# EAGLE board DZ60_Demoboard_V10_DLN18703 (EAGLE 9.6.2)
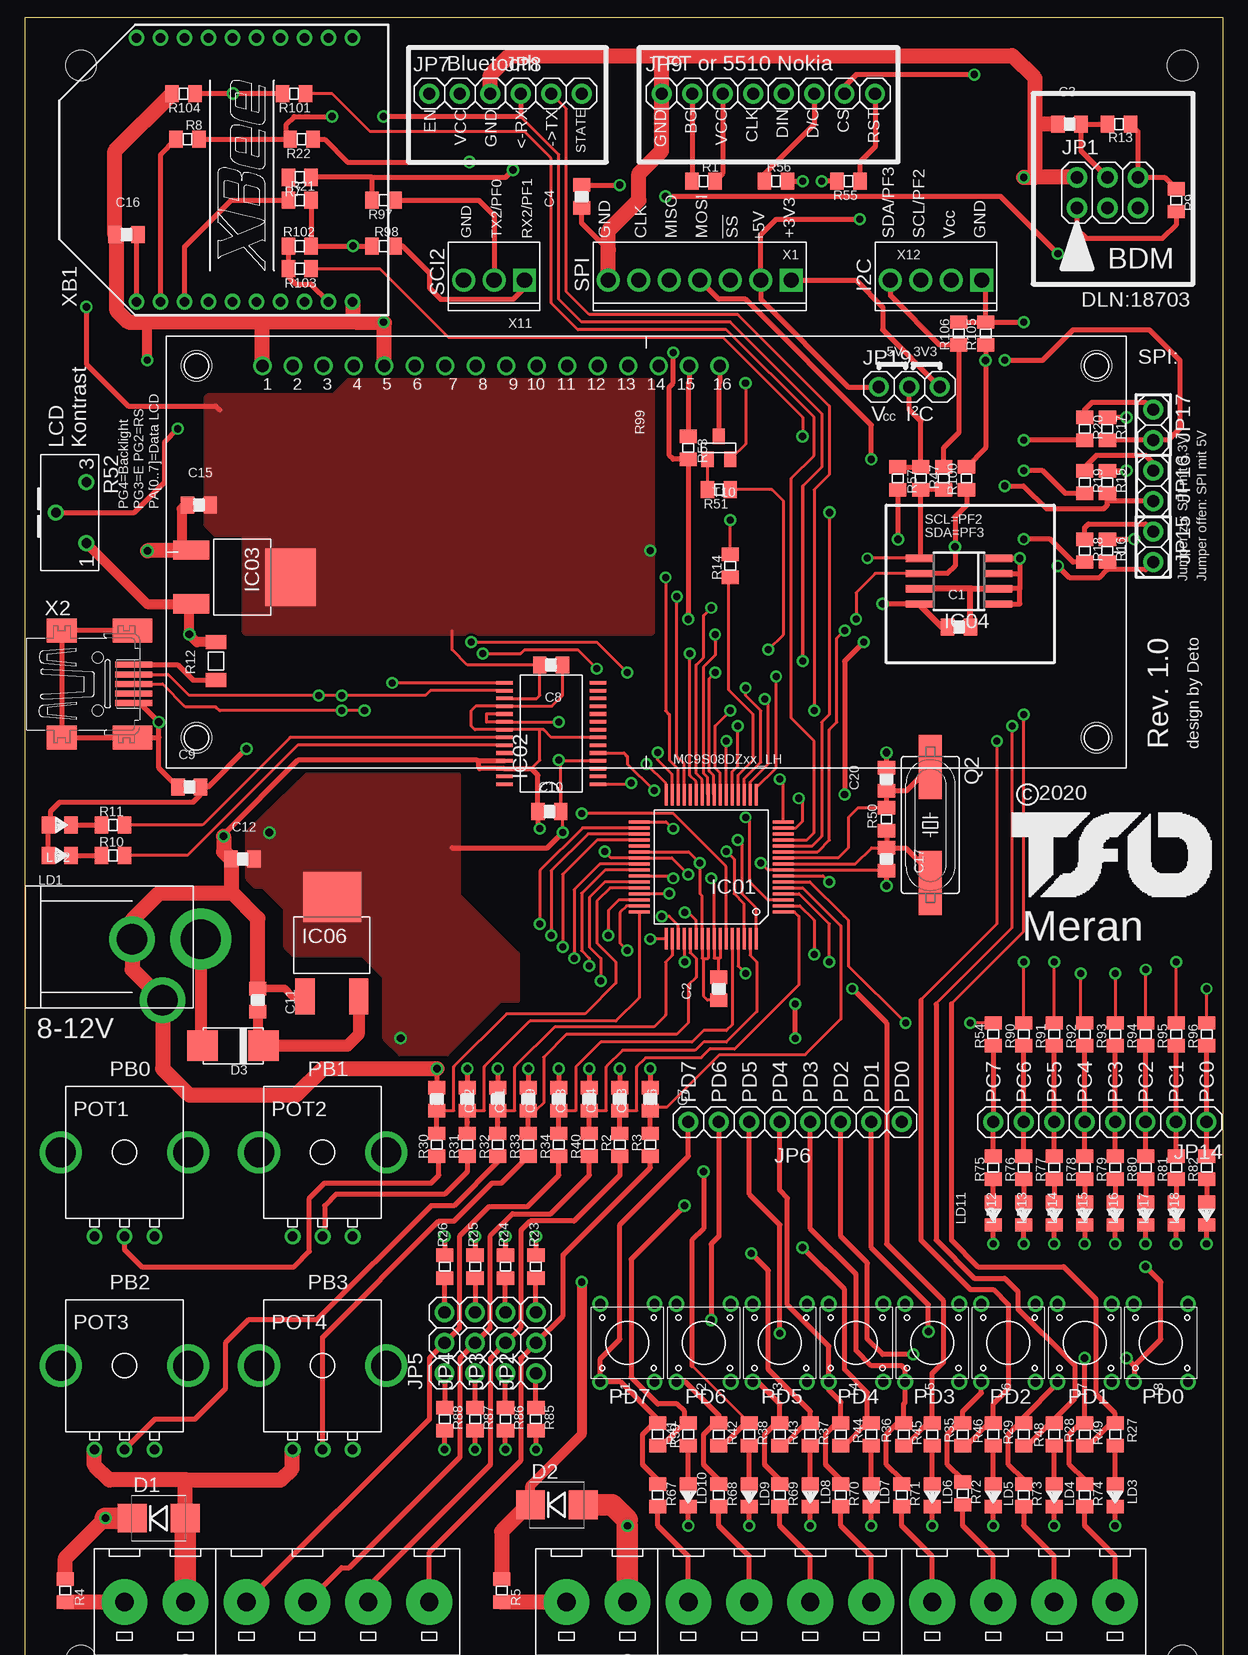
[diagram p4: board, top side]
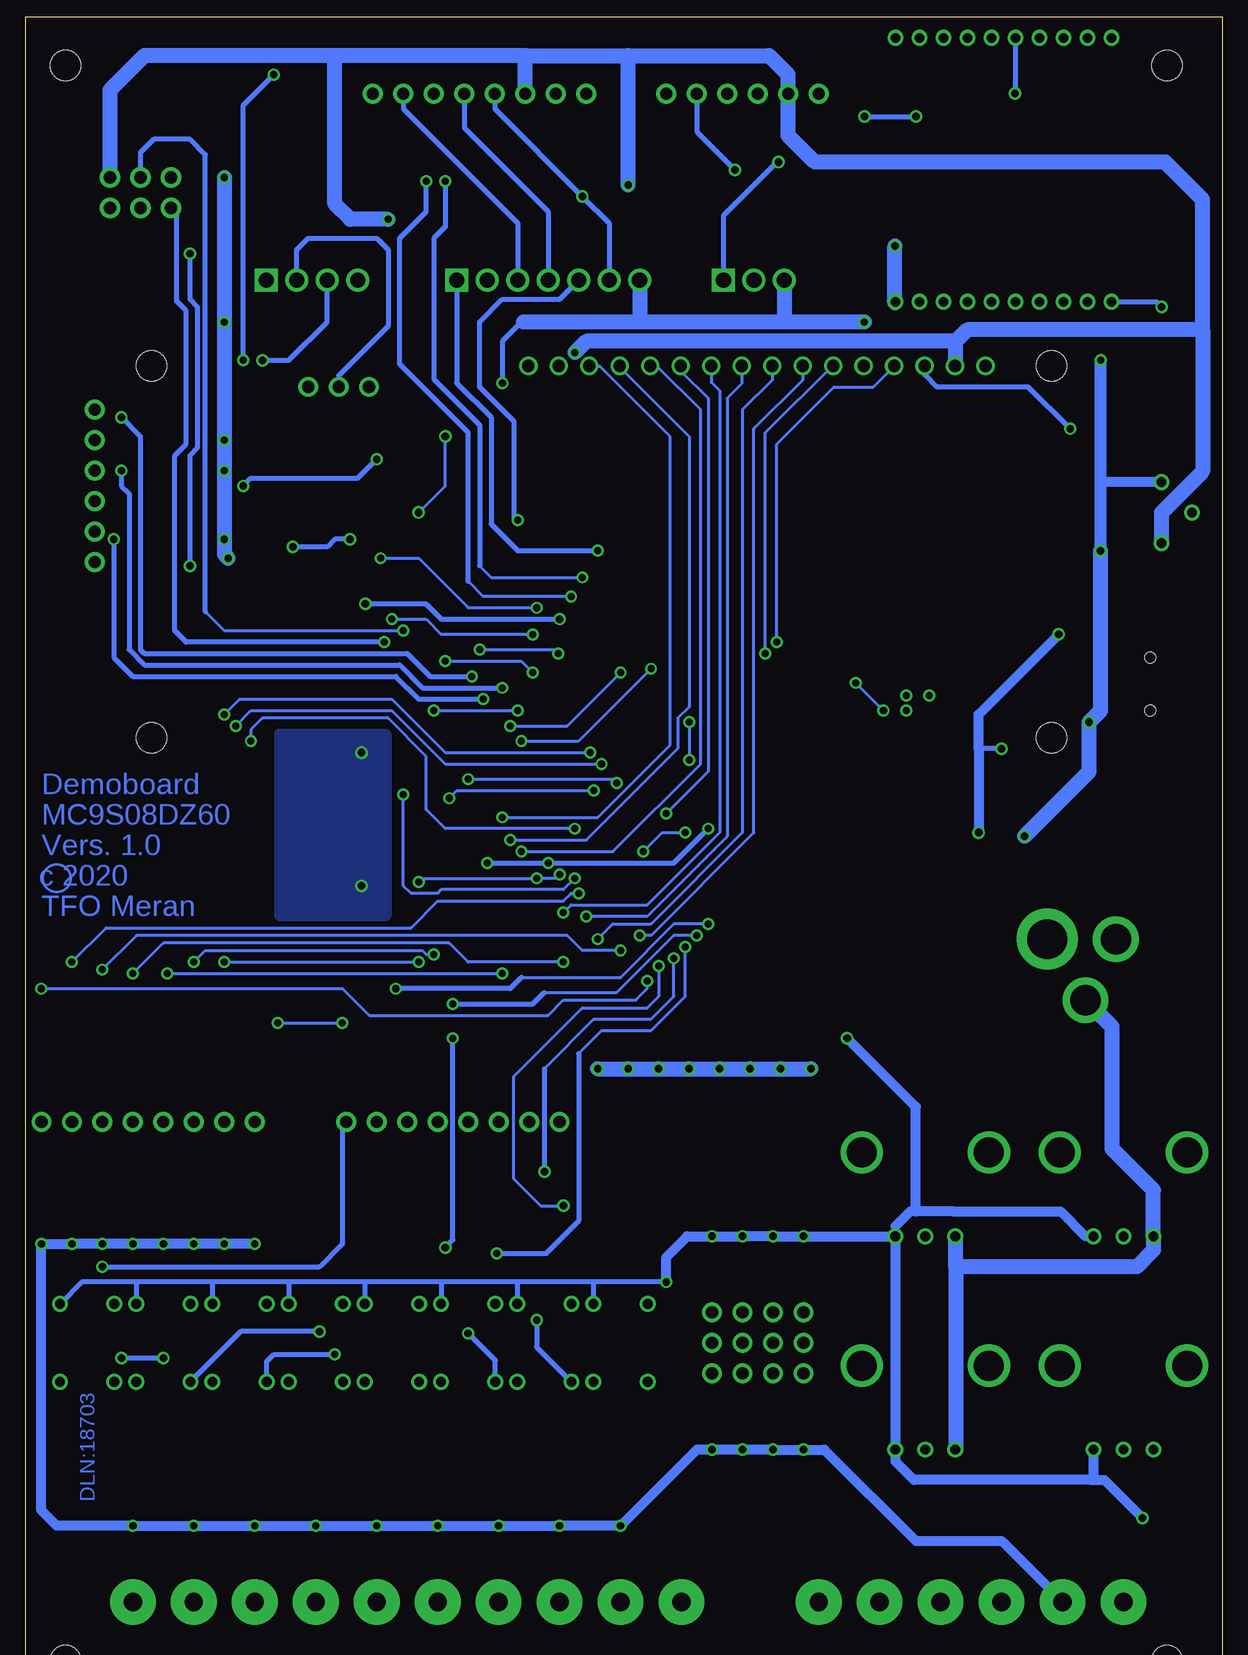
[diagram p5: board, bottom side, seen from below]

No outline drawn. Coordinates in mm, seen from the top.
Copper layers (1*16): Top 0.035mm / dielectric 1.5mm / Bottom 0.035mm
Design rules "default *": minimum track width 10mil, minimum drill 23mil, track to track 8mil, track to pad 8mil, pad to pad 8mil, via to via 8mil, smd to smd 0mil, copper to edge 40mil, drill to drill 8mil, minimum pad ring 10mil, minimum via ring 8mil, stop-mask expansion 0mil, vias tented up to drill 0mil, thermal gap 10mil
Holes 2.54 mm at 4.63,136.97 96.41,136.97 96.41,4 4.63,4
Milling: 4 lines

## Footprints (pad centres in the part's own frame; a part is rotated, then mirrored left to right if it is on the bottom)
0805F = smd 1.118 x 1.422: 1 -0.953,0; 2 0.953,0
SMB = smd 2.4 x 2.4: A 2.2,0; C -2.2,0
MELF_B = smd 2.54 x 2.54: A 2.54,0; K -2.54,0
LQFP64 = smd 1.778 x 0.254: 1 -6,3.75; 2 -6,3.25; 3 -6,2.75; 4 -6,2.25; 5 -6,1.75; 6 -6,1.25; 7 -6,0.75; 8 -6,0.25; 9 -6,-0.25; 10 -6,-0.75; 11 -6,-1.25; 12 -6,-1.75; 13 -6,-2.25; 14 -6,-2.75; 15 -6,-3.25; 16 -6,-3.75; 33 6,-3.75; 34 6,-3.25; 35 6,-2.75; 36 6,-2.25; 37 6,-1.75; 38 6,-1.25; 39 6,-0.75; 40 6,-0.25; 41 6,0.25; 42 6,0.75; 43 6,1.25; 44 6,1.75; 45 6,2.25; 46 6,2.75; 47 6,3.25; 48 6,3.75 | smd 0.254 x 1.778: 17 -3.75,-6; 18 -3.25,-6; 19 -2.75,-6; 20 -2.25,-6; 21 -1.75,-6; 22 -1.25,-6; 23 -0.75,-6; 24 -0.25,-6; 25 0.25,-6; 26 0.75,-6; 27 1.25,-6; 28 1.75,-6; 29 2.25,-6; 30 2.75,-6; 31 3.25,-6; 32 3.75,-6; 49 3.75,6; 50 3.25,6; 51 2.75,6; 52 2.25,6; 53 1.75,6; 54 1.25,6; 55 0.75,6; 56 0.25,6; 57 -0.25,6; 58 -0.75,6; 59 -1.25,6; 60 -1.75,6; 61 -2.25,6; 62 -2.75,6; 63 -3.25,6; 64 -3.75,6
SSOP28 = smd 1.4 x 0.3: 1 -3.9,4.225; 2 -3.9,3.575; 3 -3.9,2.925; 4 -3.9,2.275; 5 -3.9,1.625; 6 -3.9,0.975; 7 -3.9,0.325; 8 -3.9,-0.325; 9 -3.9,-0.975; 10 -3.9,-1.625; 11 -3.9,-2.275; 12 -3.9,-2.925; 13 -3.9,-3.575; 14 -3.9,-4.225; 15 3.9,-4.225; 16 3.9,-3.575; 17 3.9,-2.925; 18 3.9,-2.275; 19 3.9,-1.625; 20 3.9,-0.975; 21 3.9,-0.325; 22 3.9,0.325; 23 3.9,0.975; 24 3.9,1.625; 25 3.9,2.275; 26 3.9,2.925; 27 3.9,3.575; 28 3.9,4.225
DPAK = smd 1.6 x 2.997: 1 -2.261,-3.658; 3 2.21,-3.658 | smd 4.826 x 4.191: 4 0,4.623
SO-08M = smd 0.6 x 2.2: 1 -1.905,-3.33; 2 -0.635,-3.33; 3 0.635,-3.33; 4 1.905,-3.33; 5 1.905,3.33; 6 0.635,3.33; 7 -0.635,3.33; 8 -1.905,3.33
2X03 = drill 1.016 pad 1.676: 1 -2.54,-1.27; 2 -2.54,1.27; 3 0,-1.27; 4 0,1.27; 5 2.54,-1.27; 6 2.54,1.27
1X03 = drill 1.016 pad 1.651: 1 -2.54,0; 2 0,0; 3 2.54,0
1X08 = drill 1.016 pad 1.651: 1 -8.89,0; 2 -6.35,0; 3 -3.81,0; 4 -1.27,0; 5 1.27,0; 6 3.81,0; 7 6.35,0; 8 8.89,0
1X02 = drill 1.016 pad 1.651: 1 -1.27,0; 2 1.27,0
0805LED = smd 1.118 x 1.422: A 0.953,0; K -0.953,0
ALPS_VERTICAL = drill 0.813: 1 -2.5,0; 2 0,0; 3 2.5,0 | drill 2.5: C1 -5.3,7; C2 5.3,7
HC49UP = smd 5.334 x 1.93: 1 -4.826,0; 2 4.826,0
0805 = smd 1.118 x 1.422: 1 -0.953,0; 2 0.953,0
1206 = smd 1.168 x 1.727: 1 -1.587,0; 2 1.587,0
S63X = drill 0.813: 1 2.54,0; 2 0,-2.54; 3 -2.54,0
TASTE_THT = drill 0.813: A1 -3.251,2.261; A2 3.251,2.261; B1 -3.251,-2.261; B2 3.251,-2.261
SOT-23 = smd 1.016 x 1.27: 1 -0.953,0.953; 2 0.953,0.953; 3 0,-0.953
MX7 = drill 1.27 square: 1 -7.62,0 | drill 1.27: 2 -5.08,0; 3 -2.54,0; 4 0,0; 5 2.54,0; 6 5.08,0; 7 7.62,0
32005-201 = smd 3.1 x 0.5: 1 3,1.6; 2 3,0.8; 3 3,0; 4 3,-0.8; 5 3,-1.6 | smd 2.5 x 2: M1 -3,-4.45; M2 -3,4.45 | smd 3.3 x 2: M3 2.9,4.45; M4 2.9,-4.45 | hole 0.9: 0,2.2; 0,-2.2
KLEMME2 = drill 1.524 pad 3.81: 1 0,-2.54; 2 0,2.54
SPP = drill 2.54 pad 3.81: 1 0,0; 3 -2.54,5.08 | drill 3.302 pad 5.08: 2 -5.715,0
KLEMME4 = drill 1.524 pad 3.81: 1 0,-7.62; 2 0,-2.54; 3 0,2.54; 4 0,7.62
FDCC1602G = drill 1.016: 1 8,33.5; 2 10.54,33.5; 3 13.08,33.5; 4 15.62,33.5; 5 18.16,33.5; 6 20.7,33.5; 7 23.24,33.5; 8 25.78,33.5; 9 28.32,33.5; 10 30.86,33.5; 11 33.4,33.5; 12 35.94,33.5; 13 38.48,33.5; 14 41.02,33.5; 15 43.56,33.5; 16 46.1,33.5 | hole 2.54: 2.5,2.5; 77.5,2.5; 77.5,33.5; 2.5,33.5
MX3 = drill 1.27 square: 1 -2.54,0 | drill 1.27: 2 0,0; 3 2.54,0
MX4 = drill 1.27 square: 1 -3.81,0 | drill 1.27: 2 -1.27,0; 3 1.27,0; 4 3.81,0
XBEE = drill 0.8 pad 1.27: 1 -11,9; 2 -11,7; 3 -11,5; 4 -11,3; 5 -11,1; 6 -11,-1; 7 -11,-3; 8 -11,-5; 9 -11,-7; 10 -11,-9; 11 11,-9; 12 11,-7; 13 11,-5; 14 11,-3; 15 11,-1; 16 11,1; 17 11,3; 18 11,5; 19 11,7; 20 11,9

## Placement (x,y rotation side)
C1  100nF  [0805F]  77.79,90.17 0 top
C2  100nF  [0805F]  57.78,60.01 90 top
C3  100nF  [0805F]  87,132.08 0 top
C4  100nF  [0805F]  46.35,126.05 90 top
C6  10nF  [0805F]  49.53,50.8 270 top
C7  10nF  [0805F]  52.07,50.8 270 top
C8  100nF  [0805F]  43.81,87 180 top
C9  100nF  [0805F]  13.65,76.83 0 top
C10  100nF  [0805F]  43.66,74.77 0 top
C11  1µF  [0805F]  19.37,59.05 270 top
C12  1µF  [0805F]  18.1,70.8 0 top
C13  10nF  [0805F]  46.99,50.8 270 top
C14  10nF  [0805F]  44.45,50.8 270 top
C15  1µF  [0805F]  14.45,100.33 0 top
C16  100nF  [0805F]  8.41,122.87 0 top
C17  10pF  [0805F]  71.75,70.8 270 top
C18  10nF  [0805F]  41.91,50.8 270 top
C19  10nF  [0805F]  39.37,50.8 270 top
C20  10pF  [0805F]  71.75,77.47 90 top
C21  10nF  [0805F]  36.83,50.8 270 top
C22  10nF  [0805F]  34.29,50.8 270 top
D1  SA5.0CA  [SMB]  11.11,15.88 0 top
D2  SA5.0CA  [SMB]  44.29,16.99 0 top
D3  1N4007  [MELF_B]  17.3,55.24 180 top
IC01  MC9S08DZ60LH  [LQFP64]  57.15,70.17 180 top
IC02  FT232RL  [SSOP28]  43.81,81.28 180 top
IC03  LM1117-3V3  [DPAK]  17.46,94.3 270 top
IC04  24LC256  [SO-08M]  77.79,93.98 90 top
IC06  LM1117-5.0  [DPAK]  25.56,63.02 0 top
JP1  [2X03]  90.17,126.37 0 top
JP2  [1X03]  42.54,30.48 90 top
JP3  [1X03]  40,30.48 90 top
JP4  [1X03]  37.46,30.48 90 top
JP5  [1X03]  34.92,30.48 90 top
JP6  [1X08]  64.14,48.9 180 top
JP7  [1X03]  36.2,134.62 0 top
JP8  [1X03]  43.81,134.62 0 top
JP9  [1X08]  61.91,134.62 0 top
JP14  [1X08]  89.54,48.89 180 top
JP15  [1X02]  93.98,96.84 270 top
JP16  [1X02]  93.98,101.92 270 top
JP17  [1X02]  93.98,107 270 top
JP19  [1X03]  73.66,110.17 0 top
LD1  RED  [0805LED]  2.86,71.12 180 top
LD2  GRN  [0805LED]  2.86,73.66 180 top
LD3  [0805LED]  90.81,17.78 90 top
LD4  [0805LED]  85.72,17.78 90 top
LD5  [0805LED]  80.64,17.78 90 top
LD6  [0805LED]  75.56,17.78 90 top
LD7  [0805LED]  70.48,17.78 90 top
LD8  [0805LED]  65.4,17.78 90 top
LD9  [0805LED]  60.32,17.78 90 top
LD10  [0805LED]  55.24,17.78 90 top
LD11  [0805LED]  80.64,41.28 90 top
LD12  [0805LED]  83.18,41.28 90 top
LD13  [0805LED]  85.72,41.28 90 top
LD14  [0805LED]  88.26,41.28 90 top
LD15  [0805LED]  90.81,41.28 90 top
LD16  [0805LED]  93.35,41.28 90 top
LD17  [0805LED]  95.89,41.28 90 top
LD18  [0805LED]  98.43,41.28 90 top
POT1  50k  [ALPS_VERTICAL]  8.25,39.37 0 top
POT2  50k  [ALPS_VERTICAL]  24.76,39.37 0 top
POT3  50k  [ALPS_VERTICAL]  8.25,21.59 0 top
POT4  50k  [ALPS_VERTICAL]  24.76,21.59 0 top
Q2  4M9152  [HC49UP]  75.41,73.66 270 top
R1  100R  [0805]  56.52,127.32 180 top
R2  10k  [0805]  49.53,46.99 270 top
R3  10k  [0805]  52.07,46.99 270 top
R4  10R  [0805]  3.33,9.84 90 top
R5  10R  [0805]  39.69,9.84 90 top
R7  2k2  [0805]  22.86,127.64 0 top
R8  100R  [0805]  13.49,130.81 180 top
R9  10k  [0805]  95.89,125.73 90 top
R10  270R  [0805]  7.3,71.12 180 top
R11  270R  [0805]  7.3,73.66 180 top
R12  Ferrit  [1206]  15.88,87.31 90 top
R13  10k  [0805]  91.12,132.08 0 top
R14  100R  [0805]  58.74,95.25 270 top
R15  2k2  [0805]  90.17,102.23 90 top
R16  2k2  [0805]  90.17,96.52 90 top
R17  2k2  [0805]  90.17,106.68 90 top
R18  3k3  [0805]  88.27,96.52 90 top
R19  3k3  [0805]  88.27,102.23 90 top
R20  3k3  [0805]  88.27,106.68 90 top
R21  3k3  [0805]  22.86,125.73 180 top
R22  100R  [0805]  23.02,130.81 0 top
R23  10k  [0805]  42.54,36.83 90 top
R24  10k  [0805]  40,36.83 90 top
R25  10k  [0805]  37.46,36.83 90 top
R26  10k  [0805]  34.92,36.83 90 top
R27  1k  [0805]  90.8,22.86 270 top
R28  1k  [0805]  85.72,22.86 270 top
R29  1k  [0805]  80.64,22.86 270 top
R30  10k  [0805]  34.29,46.99 270 top
R31  10k  [0805]  36.83,46.99 270 top
R32  10k  [0805]  39.37,46.99 270 top
R33  10k  [0805]  41.91,46.99 270 top
R34  10k  [0805]  44.45,46.99 270 top
R35  1k  [0805]  75.57,22.86 270 top
R36  1k  [0805]  70.49,22.86 270 top
R37  1k  [0805]  65.4,22.86 270 top
R38  1k  [0805]  60.32,22.86 270 top
R39  1k  [0805]  55.24,22.86 270 top
R40  10k  [0805]  46.99,46.99 270 top
R41  1k  [0805]  52.71,22.86 90 top
R42  1k  [0805]  57.78,22.86 90 top
R43  1k  [0805]  62.86,22.86 90 top
R44  1k  [0805]  67.94,22.86 90 top
R45  1k  [0805]  73.18,22.86 90 top
R46  1k  [0805]  78.1,22.86 90 top
R47  1k  [0805]  74.61,102.55 90 top
R48  1k  [0805]  83.18,22.86 90 top
R49  1k  [0805]  88.27,22.86 90 top
R50  1M  [0805]  71.75,74.14 270 top
R51  1k  [0805]  57.78,101.6 0 top
R52  10k  [S63X]  5.08,99.69 270 top
R53  100R  [0805]  55.24,105.09 90 top
R54  100R  [0805]  80.65,56.2 270 top
R55  1k  [0805]  68.58,127.32 0 top
R56  1k  [0805]  62.55,127.32 180 top
R57  1k  [0805]  72.71,102.55 90 top
R67  100R  [0805]  52.7,17.78 90 top
R68  100R  [0805]  57.78,17.78 90 top
R69  100R  [0805]  62.86,17.78 90 top
R70  100R  [0805]  67.94,17.78 90 top
R71  100R  [0805]  73.02,17.78 90 top
R72  100R  [0805]  78.1,17.94 90 top
R73  100R  [0805]  83.18,17.78 90 top
R74  100R  [0805]  88.26,17.78 90 top
R75  1k  [0805]  80.64,45.09 270 top
R76  1k  [0805]  83.19,45.09 270 top
R77  1k  [0805]  85.72,45.09 270 top
R78  1k  [0805]  88.27,45.09 270 top
R79  1k  [0805]  90.81,45.09 270 top
R80  1k  [0805]  93.35,45.09 270 top
R81  1k  [0805]  95.89,45.09 270 top
R82  1k  [0805]  98.43,45.08 270 top
R85  10k  [0805]  42.54,24.13 90 top
R86  10k  [0805]  40,24.13 90 top
R87  10k  [0805]  37.46,24.13 90 top
R88  10k  [0805]  34.92,24.13 90 top
R90  100R  [0805]  83.18,56.2 270 top
R91  100R  [0805]  85.72,56.2 270 top
R92  100R  [0805]  88.27,56.2 270 top
R93  100R  [0805]  90.8,56.2 270 top
R94  100R  [0805]  93.34,56.2 270 top
R95  100R  [0805]  95.88,56.2 270 top
R96  100R  [0805]  98.43,56.2 270 top
R97  100R  [0805]  29.84,125.73 0 top
R98  nc  [0805]  29.84,121.92 180 top
R99  10R  [0805]  76.52,102.55 270 top
R100  10R  [0805]  78.42,102.55 270 top
R101  2k2  [0805]  22.38,134.62 0 top
R102  3k3  [0805]  22.86,121.92 180 top
R103  2k2  [0805]  22.86,120.02 0 top
R104  3k3  [0805]  13.18,134.62 0 top
R105  nc  [0805]  80.01,114.62 270 top
R106  nc  [0805]  77.79,114.62 270 top
T1  [TASTE_THT]  50.16,30.48 270 top
T2  [TASTE_THT]  56.52,30.48 270 top
T3  [TASTE_THT]  62.87,30.48 270 top
T4  [TASTE_THT]  69.22,30.48 270 top
T5  [TASTE_THT]  75.56,30.48 270 top
T6  [TASTE_THT]  81.91,30.48 270 top
T7  [TASTE_THT]  88.26,30.48 270 top
T8  [TASTE_THT]  94.61,30.48 270 top
T10  BC817  [SOT-23]  57.78,105.09 180 top
X1  [MX7]  56.2,119.06 180 top
X2  MINI-USB  [32005-201]  6.03,85.41 0 top
X3  [KLEMME2]  10.8,8.89 270 top
X4  SPP  [SPP]  8.89,64.14 180 top
X6  [KLEMME4]  62.86,8.89 270 top
X7  [KLEMME4]  83.18,8.89 270 top
X8  [KLEMME2]  47.63,8.89 270 top
X9  [KLEMME4]  26.03,8.89 270 top
X10  [FDCC1602G]  11.75,78.42 0 top
X11  MX254_3  [MX3]  39.05,119.06 180 top
X12  [MX4]  75.88,119.06 180 top
XB1  XBEE  [XBEE]  18.26,128.27 90 top

## Tracks (layer width: path | path; a pad name or v marks a point on that pad's centre or on a via)
+3V3  (via drill 0.6)
  Top 0.254: IC02.17 42.61,84.2 42.86,84.45 C8.2 36.83,87 35.56,88.27 35.56,89.85
  Top 0.406: X1.1 69.22,119.06 71.44,116.84 71.44,114.94 JP19.3 | XB1.1 9.26,122.76 C16.2 | v5.08,116.84 5.08,112.08 8.57,108.58 15.88,108.58 16.19,108.27
  Bottom 0.406: X1.1 63.82,110.49 60.96,107.63 60.96,98.74 58.74,96.52 v52.07,96.52 | XB1.1 5.51,117.27 v5.08,116.84
  pour Top (no thermals): 25.72,109.22 15.24,109.22 15.24,98.74 15.88,98.11 18.41,98.11 18.41,89.85 52.07,89.85 52.07,110.49 26.99,110.49
+5V  (via drill 0.58, 0.6, 0.61, 0.64 pad 1.02)
  Top 0.254: v44.77,73.03 44.77,74.61 C10.2 | C10.2 | IC02.19 38.42,82.91 38.42,82.23 39.89,82.23 IC02.20 44.43,82.25 v44.45,82.23 | 44.61,76.99 44.61,78.9 | 44.61,78.9 v44.45,79.06 | IC02.4 44.72,79 44.61,78.9 | IC01.58 57.9,62.55 57.78,62.55 | 57.78,62.55 57.4,62.55 IC01.57 57.4,68.97 v57.15,69.22 | IC01.7 66.47,69.42 v66.99,68.9 | v55.24,69.53 53.86,70.92 IC01.39 48.78,70.92 v48.26,71.44 | C2.2 57.78,62.55
  Top 0.305: C10.2 44.61,76.99
  Top 0.406: v34.92,39.37 R26.2 | v37.47,39.37 R25.2 | v40.01,39.37 R24.2 | v42.55,39.37 R23.2 | 42.07,17.14 42.09,17.12 D2.C | 35.56,71.75 43.5,71.75 v44.77,73.03 | LD1.A LD2.A 2.12,73.66 2.12,74.83 2.86,75.56 13.97,75.56 14.61,76.2 C9.2 15.24,76.83 v18.41,80.01 | R13.2 92.71,131.44 JP1.6 94.93,127.64 R9.2 | v53.98,113.03 53.98,110.49 53.66,110.17 53.66,104.46 53.98,104.14 R53.1 v55.24,90.81 | JP19.1 68.58,110.17 61.28,117.47 X1.2 61.28,122.87 62.55,124.14 v69.53,124.14 | JP9.3 58.1,127.95 R1.1 | C4.2 v49.53,127 | IC04.8 v71.44,92.08
  Top 0.508: C1.1 76.36,90.17 IC04.8
  Top 0.813: v46.35,35.56 46.35,22.86 42.07,18.57 42.07,17.14 | R52.1 10.15,92.09 IC03.3 13.65,91.94 v13.65,89.53 14.29,88.9 R12.2
  Top 1.27: R5.2 39.69,14.76 42.07,17.14 | R4.2 3.33,12.54 v6.67,15.88
  Top 1.778: v6.67,15.88 D1.C
  Bottom 0.254: v44.45,82.23 v44.45,79.06 | v48.26,71.44 46.67,73.03 v44.77,73.03 | v66.99,68.9 66.67,69.22 v57.15,69.22 55.56,69.22 v55.24,69.53
  Bottom 0.406: v46.35,35.56 52.43,35.56 | 27.27,40.2 POT2.3 | 11.43,39.37 11.39,39.37 | 11.39,39.37 | 52.43,35.56 T1.A1 | 52.43,35.56 58.78,35.56 | 58.78,35.56 65.13,35.56 | 65.13,35.56 71.48,35.56 | 71.48,35.56 77.83,35.56 | 77.83,35.56 84.18,35.56 | 84.18,35.56 90.53,35.56 | 58.78,35.56 T2.A1 | 65.13,35.56 T3.A1 | 71.48,35.56 T4.A1 | 77.83,35.56 T5.A1 | 84.18,35.56 T6.A1 | 90.53,35.56 T7.A1 | 90.53,35.56 95.05,35.56 T8.A1 | v18.41,80.01 20.32,80.01 | v71.44,92.08 66.36,92.08 65.09,90.81 v55.24,90.81
  Bottom 0.813: 27.27,40.2 26.04,41.43 25.56,41.43 | 25.56,41.43 22.38,41.43 13.49,41.43 11.43,39.37 | POT1.3 11.39,39.37 | v46.35,35.56 46.35,37.62 44.61,39.37 v42.55,39.37 v40.01,39.37 v37.47,39.37 v34.92,39.37 POT2.3 | POT2.3 | POT2.3 POT4.3 27.27,20.6 25.72,19.05 10.95,19.05 | v6.67,15.88 9.84,19.05 10.95,19.05 | POT3.3 10.76,19.25 10.95,19.05 | v20.32,73.03 20.32,80.01 20.32,82.87 v13.65,89.53 | 25.56,41.43 25.56,50.16 v31.27,55.88 | X10.2 22.23,111.98
  Bottom 1.27: 1.65,114.94 1.65,103.12 5.08,99.69 R52.1 | 58.1,137.79 49.53,137.79 | 49.53,137.79 37.78,137.79 36.2,136.21 JP7.2 36.2,131.13 33.97,128.91 4.76,128.91 1.65,125.79 1.65,114.94 | 92.71,134.94 89.85,137.79 73.98,137.79 | 58.1,137.79 73.98,137.79 | JP9.3 58.1,137.79 | 1.65,114.94 21.27,114.94 22.23,113.98 | 22.23,113.98 53.02,113.98 v53.98,113.03 | 22.23,111.98 22.23,113.98 | v49.53,127 49.53,137.79 | v69.53,124.14 72.71,124.14 73.98,125.41 73.98,137.79 | JP1.6 92.71,134.94 | 92.71,134.94
  pour Top (no thermals): 19.84,68.58 19.21,68.58 18.57,69.22 18.57,73.03 23.5,77.79 36.04,77.79 36.04,67.79 40.96,62.87 40.96,59.05 39.53,59.05 35.08,54.61 31.27,54.61 30,55.88 30,60.96 28.1,62.87 22.38,62.87 21.75,63.5 21.75,66.67
ADCPB0
  Top 0.254: C22.2 35.71,49.85 35.71,53.52 40.11,57.91 46.64,57.91 49.21,60.48 49.21,62.23 47.62,63.82 47.62,67.31 48.73,68.42 IC01.44
  Top 0.406: R30.1 | R30.1 C22.2 | R30.1
ADCPB1
  Top 0.254: C21.2 38.25,49.85 38.25,53.52 42.04,57.3 49.21,57.3 51.15,59.25 IC01.48
  Top 0.406: R31.1 36.83,48.9 C21.2 | C21.2 | C21.2
ADCPB2
  Top 0.254: C19.2 40.79,49.85 40.79,53.52 44.11,56.83 52.39,56.83 53.34,57.78 arc-60 53.34,57.84 53.34,62.23 53.9,62.79 IC01.50
  Top 0.406: C19.2 | R32.1 39.37,48.9 C19.2 | C19.2 | C19.2
ADCPB3
  Top 0.254: IC01.53 55.4,63.03 55.88,62.55 55.88,60.96 55.24,60.33 55.24,57.17 54.27,56.2 45.09,56.2 43.18,54.29 43.18,50.48 42.55,49.85 C18.2
  Top 0.406: C18.2 | R33.1 C18.2 | C18.2 | C18.2
ADCPB4
  Top 0.254: C14.2 45.87,49.85 45.87,53.49 47.94,55.56 55.56,55.56 56.52,56.52 58.42,56.52 58.9,56.99 IC01.60
  Top 0.406: R34.1 C14.2
ADCPB5
  Top 0.254: C13.2 48.41,49.85 48.41,53.52 49.76,54.86 55.82,54.86 56.52,55.56 58.42,55.56 60.96,58.1 60.96,62.23 60.4,62.79 IC01.63
  Top 0.406: R40.1 C13.2
ADCPB6
  Top 0.254: C6.2 50.95,49.85 50.95,53.52 51.69,54.25 56.32,54.25 56.32,54.27 57.03,54.98 59.1,54.98 64.45,60.33 64.45,66.04 64.08,66.42 IC01.1
  Top 0.406: 49.53,49.69 C6.2 | R2.1 49.53,49.69 | 49.53,49.69 C6.2 | 49.53,49.69
ADCPB7
  Top 0.254: 52.39,50.16 53.5,50.16 57.85,54.52 65,54.52 67.94,57.47 67.94,65.24 64.77,68.42 IC01.5
  Top 0.406: 52.39,50.16 C7.2 R3.1
ANA0
  Top 0.406: R30.2 34.29,45.72 34.45,45.56 34.45,44.45 33.81,43.81 24.92,43.81 23.65,42.55 23.65,38.1 22.38,36.83 9.68,36.83 8.26,38.26 POT1.2
ANA1
  Top 0.406: POT2.2 24.92,39.53 24.92,41.91 25.88,42.86 34.92,42.86 36.76,44.69 arc45 36.83,44.87 R31.2
ANA2
  Top 0.406: R32.2 39.37,45.56 35.72,41.91 33.81,41.91 24.29,32.38 18.57,32.38 16.67,30.48 16.67,26.67 14.13,24.13 10.79,24.13 POT3.2
ANA3
  Top 0.406: POT4.2 24.77,30.96 34.45,40.64 35.72,40.64 38.89,43.81 39.69,43.81 R33.2
ANA4
  Top 0.406: R34.2 44.61,45.88 44.45,45.72 44.45,44.45 41.86,41.86 38.66,41.86 36.16,39.35 36.16,31.71 JP5.2 33.66,29.21 33.66,24.13 X9.1 | R34.2
ANA5
  Top 0.406: R40.2 46.99,44.45 43.79,41.25 40.59,41.25 38.7,39.35 38.7,31.71 JP4.2 36.2,29.21 36.2,20.95 26.99,11.75 26.35,11.75 X9.2
ANA6
  Top 0.406: X9.3 28.57,10.16 38.73,20.32 38.73,20.64 38.73,29.21 JP3.2 | 49.53,45.88 | 49.53,45.88 R2.2 | 49.53,45.88 49.53,44.45 45.72,40.64 42.07,40.64 41.31,39.88 41.31,31.79 JP3.2 | JP3.2
ANA7
  Top 0.406: 52.23,46.04 | 52.23,46.04 R3.2 | 52.23,46.04 52.07,45.88 52.07,45.09 44.81,37.82 44.81,32.74 JP2.2 41.27,29.21 41.27,20.64 33.66,13.02 X9.4
BKGD  (via drill 0.58, 0.6)
  Top 0.254: IC01.42 53.77,69.42 v53.98,69.22
  Top 0.406: v68.26,76.2 68.26,87.31 v69.85,88.9 | JP1.1 87.63,123.35 88.42,122.56 94.77,122.56 95.89,123.67 R9.1
  Bottom 0.254: v68.26,76.2 68.26,68.58 67.63,67.94 65.41,67.94 65.09,68.26 54.93,68.26 v53.98,69.22
  Bottom 0.406: JP1.1 87.15,124.62 87.15,117.32 86.36,116.52 86.36,105.41 87.31,104.46 87.31,89.85 86.36,88.9 v69.85,88.9
CLK  (via drill 0.58, 0.6)
  Top 0.254: v61.59,84.14 61.91,83.82 61.91,78.74 60.4,77.23 IC01.18
  Top 0.406: R16.2 v92.39,97.47
  Bottom 0.406: v61.59,84.14 66.99,84.14 68.9,86.04 90.81,86.04 92.39,87.63 v92.39,97.47
D0  (via drill 0.58)
  Top 0.254: IC01.46 49.46,67.42 48.58,66.53 v48.58,64.45
  Bottom 0.254: X10.7 34.99,110.75 39.05,106.68 39.05,73.03 47.62,64.45 v48.58,64.45
D1  (via drill 0.58)
  Top 0.254: IC01.49 53.37,64.14 v52.07,64.14
  Bottom 0.254: X10.8 37.53,110.75 40.01,108.27 40.01,73.03 47.62,65.41 50.8,65.41 v52.07,64.14
D2  (via drill 0.58)
  Top 0.254: IC01.51 54.4,65.3 53.66,66.04 v53.02,66.04
  Bottom 0.254: X10.9 40.07,110.43 41.27,109.22 41.27,72.71 47.94,66.04 v53.02,66.04
D3  (via drill 0.58)
  Top 0.254: IC01.54 55.9,65.7 55.24,66.36 v54.93,66.36
  Bottom 0.254: X10.10 42.61,110.55 41.91,109.86 41.91,73.03 47.94,66.99 54.29,66.99 v54.93,66.36
D4  (via drill 0.58)
  Top 0.254: IC01.59 58.4,70.19 53.98,74.61 v46.35,74.61
  Bottom 0.254: X10.11 45.15,111.5 42.86,109.22 42.86,78.11 v46.35,74.61
D5  (via drill 0.58)
  Top 0.254: v58.42,71.44 59.05,70.8 59.05,67.93 59.9,67.09 IC01.62
  Bottom 0.254: X10.12 47.15,111.92 43.5,108.27 43.5,78.74 50.8,71.44 v58.42,71.44
D6  (via drill 0.58)
  Top 0.254: IC01.64 60.9,66.73 59.69,67.94 59.69,72.07 v59.37,72.39
  Bottom 0.254: X10.13 50.23,111.82 44.45,106.05 44.45,83.5 45.4,82.55 45.4,80.01 53.02,72.39 v59.37,72.39
D7  (via drill 0.58)
  Top 0.254: v60.01,74.3 60.33,73.98 60.33,68.94 61.85,67.42 IC01.3
  Bottom 0.254: X10.14 51.91,111.92 46.04,106.05 46.04,80.33 52.07,74.3 v60.01,74.3
DC_TFT  (via drill 0.58, 0.6)
  Top 0.254: IC01.30 54.4,78.31 53.66,79.06 53.66,82.87 53.34,83.19 v53.34,94.3
  Top 0.406: R56.1 v64.77,127.32
  Bottom 0.254: 61.91,95.25 60.96,94.3 v53.34,94.3
  Bottom 0.406: v64.77,127.32 64.77,123.51 65.72,122.56 65.72,110.81 61.91,107 61.91,95.25
DTR_XBEE  (via drill 0.64 pad 1.02)
  Top 0.254: v66.99,99.69 66.99,82.87 66.36,82.23 66.36,72.71 65.57,71.92 IC01.12 | v64.77,106.05 64.77,107.63 58.1,114.3 35.24,114.3 29.53,120.02 R103.2
  Bottom 0.254: v66.99,99.69 64.77,101.92 v64.77,106.05
E  (via drill 0.58)
  Top 0.254: IC01.22 58.4,80.62 v58.42,80.64 | v38.1,87.95 41.27,87.95 41.59,88.27 46.04,88.27 v47.62,86.68
  Bottom 0.254: v38.1,87.95 38.1,106.36 32.54,111.92 X10.6 | v58.42,80.64 53.66,80.64 v47.62,86.68
EXTAL
  Top 0.254: IC01.10 67.74,70.92 68.58,71.75 68.58,74.3 69.37,75.09 R50.1
  Top 0.406: R50.1 C20.1 73.44,76.52 Q2.1
GND  (via drill 0.58, 0.6, 0.61, 0.64 pad 1.02)
  Top 0.254: v60.01,110.49 60.01,105.41 T10.1 | IC02.7 43.82,80.95 43.17,81.61 42.86,81.61 | 42.86,81.61 IC02.21 37.46,81.61 37.15,81.92 37.15,83.19 37.52,83.56 IC02.18 43.87,83.56 44.77,84.45 C8.1 | 37.85,78.36 37.78,78.42 | 42.86,81.61 42.86,79.06 42.16,78.36 | IC01.56 56.9,62.55 56.52,62.55 | 56.52,62.55 56.4,62.55 IC01.55 56.4,67.74 56.2,67.94 v56.2,70.48 55.27,71.42 IC01.38 | v61.28,70.48 61.84,69.92 IC01.8 71.69,69.92 C17.2 | C2.1 56.83,59.05 56.52,59.37 56.52,62.55
  Top 0.406: v55.24,15.24 LD10.K | v90.81,15.24 LD3.K | v90.81,15.24 | v85.72,15.24 LD4.K | v80.64,15.24 LD5.K | v60.33,15.24 LD9.K | v65.41,15.24 LD8.K | v70.48,15.24 LD7.K | v75.56,15.24 LD6.K | 50.16,9.05 | 50.16,9.05 X8.2 | v34.29,53.34 C22.1 | v36.83,53.34 C21.1 | v36.83,53.34 | v41.91,53.34 41.91,53.18 | 41.91,53.18 C18.1 | 41.91,53.18 | v44.45,53.34 C14.1 | v46.99,53.34 C13.1 | v49.53,53.34 C6.1 | 52.07,53.18 v52.07,53.34 | 52.07,53.18 C7.1 | 52.07,53.18 | v34.92,21.59 R88.1 | v37.47,21.59 R87.1 | v37.47,21.59 | v40.01,21.59 R86.1 | R85.1 v42.55,21.59 | v42.55,21.59 | v39.37,53.34 C19.1 | v39.37,53.34 | v50.16,15.24 50.16,15.72 | X3.2 | X3.2 13.31,8.91 | 22.23,21.59 POT4.1 | v71.75,68.58 C17.2 | C20.2 v71.75,79.69 | R21.1 R102.1 v27.3,121.92 R98.2 | v16.51,72.71 16.51,72.87 22.7,79.06 37.62,79.06 37.68,79 37.78,79 | R106.1 R105.1 | 29.91,115.51 v29.84,115.57 | v16.51,72.71 | R105.1 80.01,118.75 X12.1 | 48.58,121.6 46.35,123.83 C4.1 | R105.1 v83.19,115.57 | R20.1 v83.19,105.73 | R19.1 86.68,101.28 84.77,103.19 v83.19,103.19 | R18.1 87.31,95.57 85.41,97.47 v83.19,97.47 | IC04.1 82.87,92.08 82.87,93.34 | 82.87,93.34 IC04.2 | IC04.3 82.87,94.61 | 82.87,94.61 82.87,93.34 | IC04.4 v82.87,95.89 82.87,94.61 | IC03.1 13.02,96.56 13.02,96.52 | C9.1 | C9.1 11.11,78.42 11.11,80.96 | X2.5 9.54,83.81 v11.11,82.23 11.11,80.96 | X2.M3 X2.M2 X2.M1 X2.M4 11.11,80.96 | v98.42,38.73 LD18.K | v95.89,38.73 LD17.K | v93.34,38.73 LD16.K | v90.81,38.73 LD15.K | v85.72,38.73 LD13.K | v83.19,38.73 LD12.K | v80.64,38.73 LD11.K | LD14.K v88.27,38.73 | IC02.25 37.78,79 | 37.85,78.36 IC02.26 42.16,78.36 42.7,77.81 C10.1 42.7,73.5 v42.86,73.34 | 37.78,78.42 37.78,79
  Top 0.508: 78.9,93.34 IC04.7 | 78.9,93.34 IC04.2 | C1.2 78.74,93.19 78.9,93.34
  Top 0.61: 17.14,67.94 17.3,67.94 | IC06.1 22.23,59.37 21.59,60.01 C11.1 | X4.1
  Top 0.813: 13.31,18.87 13.49,19.05 | 27.26,115.78 27.46,115.57 | v10.16,112.39 10.16,115.57 | C15.1 13.34,100.33 13.02,100.01 13.02,96.52 | v34.29,53.34
  Top 1.27: 22.23,21.59 22.23,20 21.27,19.05 13.49,19.05 6.99,19.05 5.75,20.28 POT3.1 | D1.A 13.31,18.87 | 53.02,137.79 JP9.1 53.02,129.86 51.12,127.95 51.12,125.73 48.58,123.19 48.58,121.6 X1.7 | 20,115.57 27.46,115.57 v29.84,115.57 | 20,115.57 10.16,115.57 8.57,115.57 7.62,116.52 7.62,122.71 C16.1 7.46,129.86 R104.1 | XB1.10 27.26,115.78 | 53.02,137.79 40.32,137.79 38.73,136.21 JP7.3 | 84.14,127.64 84.14,132.08 | 84.14,132.08 84.14,135.89 82.23,137.79 53.02,137.79 | C3.1 84.14,132.08 | X4.3 8.89,61.59 X4.1 8.89,65.72 11.11,67.94 17.14,67.94 C12.1 16.51,71.44 v16.51,72.71 | X10.1 19.75,115.31 20,115.57 | X10.5 29.91,115.51 | v83.19,127.64 84.14,127.64 | C11.1 19.37,65.88 17.3,67.94 | v34.29,53.34 24.77,53.34 22.54,51.12 13.65,51.12 11.43,53.34 X4.3 | 13.02,96.52 v10.16,96.52 | X4.3 | JP1.2 84.14,127.64 | 84.14,127.64
  Top 1.778: v50.16,15.24 50.16,9.05 | 50.16,15.72 48.9,16.99 D2.A | 13.31,8.91 D1.A
  Bottom 0.254: 48.58,115.89 48.26,115.57
  Bottom 0.406: v95.89,38.73 96.04,38.73 | POT4.1 22.23,21.63 | XB1.10 27.26,117.21 27.3,117.16 | 58.26,115.57 58.42,115.57 60.01,113.98 v60.01,110.49 | v61.28,70.48 v56.2,70.48 45.72,70.48 v42.86,73.34
  Bottom 0.813: v80.64,38.73 v83.19,38.73 v85.72,38.73 v88.27,38.73 v90.81,38.73 v93.34,38.73 v95.89,38.73 | 96.04,38.73 v98.42,38.73 98.42,16.51 97.16,15.24 v90.81,15.24 v85.72,15.24 v80.64,15.24 v75.56,15.24 v70.48,15.24 v65.41,15.24 v60.33,15.24 v55.24,15.24 v50.16,15.24 43.81,21.59 v42.55,21.59 v40.01,21.59 v37.47,21.59 v34.92,21.59 33.18,21.59 25.56,13.97 18.41,13.97 X3.2 | R52.3 10.16,102.23
  Bottom 1.016: v10.16,96.52 10.16,102.23 v10.16,112.39 | v10.16,112.39 | 22.27,36.87 22.23,36.83
  Bottom 1.27: v52.07,53.34 v49.53,53.34 v46.99,53.34 v44.45,53.34 v41.91,53.34 v39.37,53.34 v36.83,53.34 v34.29,53.34 | 22.23,21.63 22.23,36.83 7.14,36.83 5.75,38.22 POT1.1 5.75,43.22 9.21,46.67 9.21,56.83 X4.3 | 27.3,117.16 v27.3,121.92 | v29.84,115.57 36.51,115.57 | 36.51,115.57 48.26,115.57 58.26,115.57 | v16.51,72.71 11.11,78.11 v11.11,82.23 10.16,83.19 v10.16,96.52 | X11.3 36.51,115.57 | X1.7 48.58,115.89 | v83.19,127.64 v83.19,115.57 v83.19,105.73 v83.19,103.19 v83.19,97.47 83.19,96.2 v82.87,95.89 | POT2.1 22.27,36.87
  pour Bottom: 69.69,81.28 69.69,66.04 78.58,66.04 78.58,81.28
LCD_LED1  (via drill 0.58)
  Top 0.254: v61.91,88.27 63.18,89.53 63.18,100.65 62.23,101.6 R51.2 | v55.37,87.95 55.37,77.79 55.9,77.26 IC01.27
  Bottom 0.254: v61.91,88.27 55.69,88.27 v55.37,87.95
MISO
  Top 0.254: IC01.20 59.4,77.81 60.64,79.06 60.64,82.87 58.62,84.89 58.62,94.18 R14.2
MOSI  (via drill 0.58, 0.6)
  Top 0.254: IC01.19 59.9,77.52 61.28,78.9 61.28,83.19 60.01,84.45 v60.01,85.09
  Top 0.406: R15.2 v91.76,103.19
  Bottom 0.406: v91.76,103.19 91.76,101.92 91.12,101.28 91.12,88.27 89.85,87 68.58,87 66.67,85.09 v60.01,85.09
N$1
  Top 0.406: X10.15 55.31,110.55 55.24,110.49 R53.2
N$2
  Top 0.406: LD1.K R10.2
N$3  (via drill 0.6)
  Top 0.254: R14.1 v58.74,99.06
  Bottom 0.406: v58.74,99.06 59.05,99.38 59.05,107.31 61.91,110.17 61.91,115.57 60.01,117.47 55.24,117.47 X1.5
N$5
  Top 0.254: R10.1 13.49,71.12 20.24,77.87 20.25,77.88 22.68,80.31 IC02.23
N$6
  Top 0.406: LD2.K R11.2
N$7
  Top 0.254: R11.1 14.76,73.66 22.06,80.95 IC02.22
N$13
  Top 0.406: JP9.8 70.8,130.18 69.53,128.91 R55.2
N$14
  Top 0.406: LD11.A R75.2
N$15
  Top 0.406: R76.2 LD12.A | LD12.A
N$22
  Top 0.406: JP9.2 R1.2
N$24
  Top 0.406: R27.2 | LD3.A R27.2 | R27.2
N$25
  Top 0.406: 85.72,21.75 | 85.72,21.75 R28.2 | LD4.A 85.72,21.75
N$26
  Top 0.406: LD5.A R29.2
N$27
  Top 0.406: 75.56,21.75 | 75.56,21.75 R35.2 | LD6.A 75.56,21.75
N$28  (via drill 0.6)
  Top 0.406: v86.04,121.28 81.28,126.05 v53.34,126.05 | JP15.2 93.34,94.93 90.17,94.93 | v86.04,95.25 87,94.3 89.53,94.3 90.17,94.93 | 90.17,94.93 R16.1
  Bottom 0.406: JP9.4 60.64,133.35 v53.34,126.05 51.12,123.83 X1.6 | v86.04,95.25 86.04,104.46 85.41,105.09 85.41,116.84 86.04,117.47 v86.04,121.28
N$29
  Top 0.406: 70.48,21.75 | 70.48,21.75 R36.2 | LD7.A 70.48,21.75
N$30  (via drill 0.6)
  Top 0.406: v79.06,136.21 69.22,136.21 68.26,135.25 JP9.7 | R17.1 JP17.2 95.25,105.73 96.2,106.68 96.2,112.39 93.66,114.94 87.31,114.94 84.77,112.39 v81.6,112.39
  Bottom 0.406: JP9.7 68.26,133.35 58.74,123.83 X1.3 | v81.6,112.39 81.6,133.67 v79.06,136.21
N$31
  Top 0.406: LD8.A R37.2
N$32
  Top 0.406: LD9.A R38.2
N$33
  Top 0.406: LD10.A R39.2
N$35
  Top 0.406: JP9.6 65.72,132.08 61.59,127.95 R56.2
N$36
  Top 0.406: R20.2 88.27,108.27 88.9,108.9 93.34,108.9 JP17.1
N$37
  Top 0.406: JP16.1 93.98,103.82 93.34,104.46 89.22,104.46 88.27,103.5 R19.2
N$39
  Top 0.254: T10.2 R51.1
N$43
  Top 1.27: R5.1 X8.1
N$50
  Top 0.406: R18.2 88.27,98.42 88.58,98.74 93.34,98.74 JP15.1
N$51  (via drill 0.6)
  Top 0.406: v70.48,104.14 70.48,107 60.01,117.47 57.78,117.47 X1.4 | JP16.2 90.17,100.65 | v81.6,101.92 83.19,101.92 85.09,100.01 89.85,100.01 90.17,100.33 90.17,100.65 | 90.17,100.65 R15.1
  Bottom 0.406: JP9.5 63.18,131.76 56.2,124.78 X1.4 | v81.6,101.92 80.96,102.55 72.07,102.55 v70.48,104.14
N$53
  Top 0.406: R4.1
  Top 1.27: R4.1 X3.1
N$67  (via drill 0.6)
  Top 0.406: R52.2 9.05,99.69 11.59,102.23 11.59,105.57 v12.7,106.68
  Bottom 0.406: v12.7,106.68 16.19,110.17 23.81,110.17 24.83,111.19 X10.3
N$68
  Top 0.406: X10.16 57.85,110.55 57.78,110.49 T10.3
N$70
  Top 0.813: C11.2 19.37,55.24 D3.K
  Top 1.016: IC06.3 27.77,56.19 26.83,55.24 D3.K
N$71
  Top 1.016: X4.2 14.61,55.4 D3.A
N$72
  Top 0.406: R77.2 LD13.A
N$73
  Top 0.406: R78.2 LD14.A | LD14.A
N$74
  Top 0.406: R79.2 LD15.A | LD15.A
N$75
  Top 0.406: R80.2 LD16.A
N$76
  Top 0.406: R81.2 LD17.A | LD17.A
N$77
  Top 0.406: R82.2 LD18.A | LD18.A
N$78
  Top 0.406: XB1.2 11.26,129.53 R8.2
N$81
  Top 0.406: R7.1 R21.2 17.14,125.73 13.26,121.84 XB1.3
N$82  (via drill 0.64 pad 1.02)
  Top 0.406: R101.1 v17.3,134.62 R104.2
  Bottom 0.406: XB1.16 17.26,134.67 v17.3,134.62
N$85
  Top 0.406: R102.2 R103.1 21.91,119.38 22.54,118.75 23.78,118.75 XB1.9
N$89
  Top 0.406: JP5.3 R26.1
N$96
  Top 0.406: R25.1 JP4.3
N$97
  Top 0.406: JP3.3 R24.1
N$98
  Top 0.406: JP2.3 R23.1
N$99
  Top 0.406: 42.55,25.24 | R85.2 42.55,25.24 | 42.55,25.24 JP2.1
N$100
  Top 0.406: R86.2 JP3.1
N$101
  Top 0.406: 37.47,25.24 | R87.2 37.47,25.24 | 37.47,25.24 JP4.1
N$102
  Top 0.406: JP5.1 R88.2
PC0
  Top 0.406: R82.1 | R82.1 JP14.1 R96.2
PC0M  (via drill 0.58)
  Top 0.254: IC01.43 48.28,68.92 46.99,67.63 46.99,63.5 47.94,62.55 v47.94,60.64 | R96.1 | R96.1 v98.42,60.01
  Bottom 0.254: v47.94,60.64 47.94,60.01 48.9,59.05 54.93,59.05 56.2,57.78 71.12,57.78 73.34,60.01 v98.42,60.01
PC1
  Top 0.406: R81.1 | R81.1 JP14.2 | JP14.2 | JP14.2 R95.2
PC1M  (via drill 0.58)
  Top 0.254: R95.1 v95.89,62.23 | v95.89,62.23 | v53.66,67.94 53.63,67.92 IC01.45
  Bottom 0.254: v95.89,62.23 93.03,65.09 67.63,65.09 65.41,67.31 54.93,67.31 54.29,67.94 v53.66,67.94
PC2
  Top 0.406: R80.1 JP14.3 | JP14.3 | JP14.3 R94.2
PC2M  (via drill 0.58)
  Top 0.254: R94.1 v93.34,61.59 | v93.34,61.59 | v50.16,63.18 49.53,63.82 49.53,66.36 50.09,66.92 IC01.47
  Bottom 0.254: v93.34,61.59 90.49,64.45 54.61,64.45 53.34,63.18 v50.16,63.18
PC3
  Top 0.406: R79.1 | R79.1 JP14.4 | JP14.4 | JP14.4 R93.2
PC3M  (via drill 0.58)
  Top 0.254: IC01.52 54.9,62.26 v54.93,62.23 | v90.81,61.28 R93.1 | R93.1
  Bottom 0.254: v90.81,61.28 88.27,63.82 64.45,63.82 62.87,62.23 v54.93,62.23
PC4
  Top 0.406: R78.1 JP14.5 R92.2
PC4M  (via drill 0.58)
  Top 0.254: IC01.61 59.4,61.88 v60.01,61.28 | R92.1 87.95,57.47 v87.95,61.28
  Bottom 0.254: v87.95,61.28 v60.01,61.28
PC5
  Top 0.406: R77.1 | R77.1 JP14.6 | JP14.6 | JP14.6 R91.2
PC5M  (via drill 0.58)
  Top 0.254: IC01.2 64.53,66.92 65.72,65.72 v65.72,62.87 | R91.1 v85.72,62.23 | v85.72,62.23
  Bottom 0.254: v85.72,62.23 84.77,63.18 66.67,63.18 66.36,62.87 v65.72,62.87
PC6
  Top 0.406: R76.1 JP14.7 | JP14.7 | JP14.7 R90.2
PC6M  (via drill 0.58)
  Top 0.254: R90.1 v83.19,62.23 | v83.19,62.23 | v66.99,62.23 66.99,65.41 64.48,67.92 IC01.4
  Bottom 0.254: v83.19,62.23 v66.99,62.23
PC7
  Top 0.406: R54.2 JP14.8 R75.1 | R75.1
PC7M  (via drill 0.58)
  Top 0.254: IC01.6 65.37,68.92 68.23,66.06 68.24,66.06 68.58,65.72 68.58,61.91 v73.34,57.15 | R54.1 v78.74,57.15
  Bottom 0.254: v78.74,57.15 v73.34,57.15
PD0  (via drill 0.61)
  Top 0.254: 92.39,27.3 92.35,27.27 T8.B2
  Top 0.406: R74.2 88.27,19.05 87,20.32 87,22.86 87.95,23.81 R49.2 v88.27,29.21 | v91.76,29.21 92.39,28.57 | 92.39,28.57 92.39,27.3 | v93.34,36.83 94.61,35.56 94.61,30.8 92.39,28.57
  Bottom 0.406: v93.34,36.83 75.25,36.83 73.34,38.73 73.34,48.58 JP6.1 | v88.27,29.21 v91.76,29.21 | v91.76,29.21
PD0M  (via drill 0.58)
  Top 0.254: IC01.31 53.9,77.86 52.7,79.06 v52.7,79.69 | v83.19,82.87 83.19,64.77 77.15,58.74
  Top 0.406: R49.1 88.58,21.91 90.49,23.81 R27.1 90.81,24.61 89.22,26.19 89.22,34.13 86.52,36.83 79.38,36.83 77.15,39.05 77.15,58.74
  Bottom 0.254: v83.19,82.87 81.92,84.14 69.22,84.14 64.77,79.69 v52.7,79.69
PD1  (via drill 0.64 pad 1.02)
  Top 0.406: R73.2 83.19,19.05 81.92,20.32 81.92,22.86 82.87,23.81 R48.2 83.19,24.29 86,27.11 T7.B2 | v75.25,31.43 75.25,33.66 70.48,38.42 JP6.2
  Bottom 0.406: v75.25,31.43 81.8,31.43 T7.B2
PD1M  (via drill 0.58)
  Top 0.254: IC01.32 53.4,77.09 v51.75,78.74 | 75.88,58.72 75.88,58.77 82.23,65.12 v82.23,81.9
  Top 0.406: R48.1 83.5,21.91 85.41,23.81 R28.1 85.72,24.13 87.47,25.88 87.47,28.57 87,29.05 | 87,29.05 | 87,29.05 82.71,33.34 82.71,34.77 81.6,35.88 79.06,35.88 75.88,39.05 75.88,58.72
  Bottom 0.254: v82.23,81.9 82.23,81.92 80.96,83.19 69.22,83.19 64.77,78.74 | 64.77,78.74 | 64.77,78.74 v51.75,78.74
PD2  (via drill 0.61)
  Top 0.406: R72.2 78.11,19.05 76.83,20.32 76.83,22.86 77.79,23.81 R46.2 78.11,24.77 79.65,26.31 T6.B2 | v73.98,29.53 71.44,29.53 70.17,30.8 70.17,37.15 67.94,39.37 JP6.3
  Bottom 0.406: v73.98,29.53 79.06,29.53 79.65,28.93 T6.B2
PD2M  (via drill 0.58)
  Top 0.254: IC01.33 53.4,73.92 v53.98,73.34 | v80.96,80.64 80.96,65.41 74.61,59.05
  Top 0.406: R46.1 78.42,21.91 80.33,23.81 R29.1 80.64,25.4 81.92,26.67 81.92,33.66 80.64,34.92 78.74,34.92 74.61,39.05 74.61,59.05
  Bottom 0.254: v53.98,73.34 64.77,73.34 66.36,74.93 66.36,79.38 69.53,82.55 80.01,82.55 80.96,81.6 v80.96,80.64
PD3
  Top 0.406: R71.2 73.03,19.05 71.75,20.32 71.75,22.86 72.71,23.81 R45.2 73.18,25.4 73.3,25.52 T5.B2 73.3,28.3 73.03,28.57 70.48,28.57 69.22,29.84 69.22,36.2 65.41,40.01 JP6.4
PD3M  (via drill 0.58)
  Top 0.254: IC01.34 46.43,73.42 42.86,69.85 v42.86,65.41
  Top 0.406: R45.1 73.34,21.91 75.25,23.81 R35.1 | R35.1 | v68.9,60.01 71.75,57.15 71.75,38.73 76.52,33.97 76.52,28.89 75.56,27.94 R35.1
  Bottom 0.254: v42.86,65.41 45.72,65.41 50.16,60.96 58.42,60.96
  Bottom 0.406: 58.42,60.96 59.37,60.01 v68.9,60.01
PD4
  Top 0.406: R70.2 67.94,19.05 66.67,20.32 66.67,22.86 67.63,23.81 R44.2 | R44.2 | R44.2 67.94,25.56 66.95,26.55 T4.B2 66.95,30.2 63.5,33.66 63.5,42.55 62.87,43.18 JP6.5
PD4M  (via drill 0.58, 0.64 pad 1.02)
  Top 0.254: IC01.35 46.88,72.92 43.81,69.85 v43.81,64.45
  Top 0.406: R44.1 68.26,21.91 70.17,23.81 | 70.17,23.81 R36.1 | v64.77,38.42 68.26,34.92 68.26,28.26 70.17,26.35 70.17,23.81 | v64.14,55.88 v64.14,58.74
  Bottom 0.254: v43.81,64.45 45.72,64.45 50.48,59.69 56.52,59.69
  Bottom 0.406: v64.77,38.42 64.14,39.05 v64.14,55.88 | v64.14,58.74 57.47,58.74 56.52,59.69
PD5  (via drill 0.61)
  Top 0.406: R69.2 62.87,19.05 61.59,20.32 61.59,22.86 62.55,23.81 | 62.55,23.81 R43.2 | 62.55,23.81 62.55,23.97 62.71,23.97 R43.2 62.87,25.4 61.04,27.23 T3.B2 | JP6.6 60.33,42.86 62.87,40.32 v62.87,31.27
  Bottom 0.406: T3.B2 60.6,29.01 v62.87,31.27
PD5M  (via drill 0.58)
  Top 0.254: IC01.36 47.65,72.42 44.77,69.53 v44.77,63.5
  Top 0.406: R43.1 63.18,21.91 65.09,23.81 R37.1 65.41,24.77 62.23,27.94 | 62.23,27.94 | 62.23,27.94 61.91,28.26 61.91,36.51 v60.48,37.94
  Bottom 0.254: 53.66,54.61 51.75,56.52 47.62,56.52 44.77,59.37 v44.77,63.5
  Bottom 0.406: v60.48,37.94 56.36,37.94 53.66,40.64 53.66,54.61
PD6  (via drill 0.6)
  Top 0.406: R68.2 57.78,19.05 56.52,20.32 56.52,22.86 57.47,23.81 57.63,23.81 | 57.63,23.81 R42.2 | T2.B2 55,27.23 57.78,24.45 57.78,23.97 57.63,23.81 | v57.15,32.38 57.15,38.73 57.78,39.37 JP6.7
  Bottom 0.406: v57.15,32.38 57.15,30.12 T2.B2
PD6M  (via drill 0.58, 0.64 pad 1.02)
  Top 0.254: IC01.40 47.88,70.42 45.72,68.26 v45.72,62.55 | R38.1 55.56,28.57
  Top 0.406: R42.1 58.1,21.91 60.01,23.81 R38.1 | 55.56,28.57 55.56,39.05 56.52,40.01 v56.52,44.77
  Bottom 0.254: v45.72,62.55 45.72,59.37 47.66,57.43 52.42,57.43 56.52,53.34
  Bottom 0.406: 56.52,53.34 v56.52,44.77
PD7
  Top 0.406: R67.2 52.7,19.05 51.44,20.32 51.44,22.86 52.39,23.81 52.55,23.81 | R41.2 52.55,23.81 | 52.55,23.81 52.7,23.97 52.7,24.13 49.61,27.23 T1.B2 47.9,29.17 49.53,30.8 49.53,40.32 55.24,46.04 JP6.8
PD7M  (via drill 0.58, 0.64 pad 1.02)
  Top 0.254: IC01.41 48.33,69.92 46.35,67.94 46.35,63.18 46.99,62.55 v46.99,61.91
  Top 0.406: R41.1 53.02,21.91 54.93,23.81 | 54.93,23.81 R39.1 | v54.93,41.91 50.48,37.47 50.48,27.62 52.7,25.4 54.29,25.4 54.93,24.77 54.93,23.81
  Bottom 0.254: v54.93,41.91 56.83,41.91 59.05,44.13 59.05,52.7 53.34,58.42 47.94,58.42 46.99,59.37 v46.99,61.91
PF0A
  Top 0.406: X7.4 90.81,12.7 88.27,15.24 R74.1 | R74.1
PF1A
  Top 0.406: X7.3 85.72,12.7 83.19,15.24 R73.1
PF2A
  Top 0.406: X7.2 80.64,12.7 78.11,15.24 R72.1 | R72.1
PF3A
  Top 0.406: X7.1 75.56,12.7 73.03,15.24 R71.1
PF4A
  Top 0.406: X6.4 70.48,12.7 67.94,15.24 R70.1 | R70.1 | R70.1
PF5A
  Top 0.406: X6.3 65.41,12.7 62.87,15.24 R69.1 | R69.1
PF6A
  Top 0.406: X6.2 60.33,12.7 57.78,15.24 R68.1 | R68.1 | R68.1
PF7A
  Top 0.406: X6.1 55.24,12.7 52.7,15.24 52.7,16.51 52.55,16.67 R67.1
RES_TFT  (via drill 0.58, 0.6)
  Top 0.254: IC01.29 54.9,78.77 54.29,79.38 v54.29,92.71
  Top 0.406: R55.1 v66.36,127.32
  Bottom 0.254: 62.87,93.98 61.59,92.71 v54.29,92.71
  Bottom 0.406: 62.87,93.98 62.87,106.36 68.58,112.08 68.58,122.56 66.36,124.78 v66.36,127.32
RESET  (via drill 0.58)
  Top 0.254: IC01.11 66.01,71.42 66.99,72.4 66.99,81.6 67.63,82.23 67.63,89.22 v68.26,89.85
  Top 0.406: R13.1 C3.2 87.95,129.86 JP1.4 | R13.1
  Bottom 0.254: 84.77,91.44 83.19,89.85 v68.26,89.85
  Bottom 0.406: JP1.4 90.17,129.7 89.06,130.81 86.04,130.81 84.77,129.54 84.77,91.44
RS  (via drill 0.58)
  Top 0.254: IC01.21 58.9,78.11 59.37,78.58 v59.37,81.92 | v50.16,86.36 47.62,88.9 v37.15,88.9
  Bottom 0.254: v59.37,81.92 54.61,81.92 v50.16,86.36 | v37.15,88.9 37.15,105.41 32.38,110.17 29.12,110.17 X10.4
RTS_XBEE
  Top 0.254: R101.2 25.56,134.62 28.73,131.44 41.59,131.44 43.81,129.22 43.81,117.16 46.04,114.94 58.42,114.94 65.72,107.63 65.72,104.46 63.82,102.55 63.82,82.55 65.72,80.64 65.72,73.03 65.11,72.42 IC01.13
RX1  (via drill 0.58)
  Top 0.254: IC01.16 63.15,77.19 v62.87,77.47 | IC02.1 50.38,77.06 v50.48,77.15
  Bottom 0.254: v62.87,77.47 50.8,77.47 v50.48,77.15
RX2  (via drill 0.58, 0.64 pad 1.02)
  Top 0.254: 41.27,132.72 44.45,129.54 44.45,117.47 46.35,115.57 58.74,115.57 66.36,107.95 66.36,103.5 64.77,101.92 | v57.48,86.36 57.43,86.31 57.43,86.3 56.97,85.84 56.97,78.15 57.36,77.76 57.36,76.21 IC01.24
  Top 0.305: 64.77,101.92 v64.77,87.31
  Top 0.406: R8.1 21.75,130.81 | R22.1 21.75,130.81 | JP8.1 41.27,132.72 v29.84,132.72 | 21.75,130.81 21.75,132.08 22.38,132.72 v25.56,132.72
  Bottom 0.254: v64.77,87.31 58.43,87.31 v57.48,86.36
  Bottom 0.406: v29.84,132.72 v25.56,132.72
RX2_PINHEAD  (via drill 0.64 pad 1.02)
  Top 0.406: R22.2 24.92,130.81 26.83,128.91 v36.99,128.91 | R98.1 31.43,121.92 33.66,119.7 33.66,118.43 34.61,117.47 40.64,117.47 41.59,118.43 X11.1
  Bottom 0.406: v36.99,128.91 37.15,128.91 41.59,124.46 X11.1
SCL_PF2  (via drill 0.58, 0.61)
  Top 0.254: IC04.6 70.8,94.61 69.22,93.03 v69.22,90.81 | v57.47,89.53 57.47,87.81 56.52,86.86 56.52,77.96 56.86,77.62 56.86,76.21 IC01.25
  Top 0.406: R100.2 78.42,100.33 77.47,99.38 v77.47,96.84 77.47,95.25 76.83,94.61 IC04.6 | R57.1 v72.71,97.47
  Bottom 0.254: v57.47,89.53 65.09,89.53 66.36,90.81 v69.22,90.81
  Bottom 0.406: v72.71,97.47 73.98,97.47 74.61,96.84 v77.47,96.84
SCL_PIN  (via drill 0.64 pad 1.02)
  Top 0.406: R100.1 80.01,105.09 v80.01,112.39 R105.2
  Bottom 0.406: v80.01,112.39 77.89,112.39 arc-45 77.71,112.47 74.61,115.57 X12.3
SDA_PF3  (via drill 0.58)
  Top 0.254: IC01.26 56.4,77.43 55.88,77.95 55.88,87 56.52,87.63 56.52,91.12 v57.15,91.76 | IC04.5 v70.17,95.89
  Top 0.406: R99.2 R47.1 74.61,96.04 IC04.5
  Bottom 0.254: v70.17,95.89 66.99,95.89 62.87,91.76 v57.15,91.76
SDA_PIN
  Top 0.406: R99.1 76.52,105.09 77.79,106.36 R106.2 76.2,113.67 72.15,117.72 arc-45 72.07,117.9 X12.4
SS/  (via drill 0.58, 0.6)
  Top 0.254: v62.55,86.04 62.55,78.42 60.9,76.78 IC01.17
  Top 0.406: R17.2 v91.76,107.63
  Bottom 0.406: v91.76,107.63 90.17,106.05 90.17,88.27 89.85,87.95 67.94,87.95 66.04,86.04 v62.55,86.04
TX1  (via drill 0.58)
  Top 0.254: IC01.15 64.21,73.42 64.77,73.98 64.77,75.56 v64.45,75.88 | v52.39,76.52 50.16,78.74 50.16,79.38 49.88,79.66 IC02.5
  Bottom 0.254: v64.45,75.88 63.82,76.52 v52.39,76.52
TX2  (via drill 0.58, 0.64 pad 1.02)
  Top 0.254: JP8.2 45.09,133.35 45.09,118.11 46.99,116.2 59.37,116.2 66.99,108.58 66.99,102.87 65.72,101.6 v65.72,83.19 | IC01.23 57.9,77.99 57.47,78.42 57.47,81.92 58.73,83.17 v58.73,83.19
  Top 0.406: 28.89,127.64 R7.2 | 28.89,127.64 40.01,127.64 v40.64,128.27 | R97.1 28.89,127.64
  Bottom 0.254: v65.72,83.19 v58.73,83.19
  Bottom 0.406: JP8.2 43.81,131.44 v40.64,128.27
TX2_PINHEAD
  Top 0.406: R97.2 37.78,125.73 39.05,124.46 X11.2
U_I2C
  Top 0.406: JP19.2 73.66,108.27 74.61,107.31 R47.2 R57.2
  Bottom 0.406: X12.2 77.15,121.6 76.2,122.56 70.48,122.56 69.53,121.6 69.53,115.25 73.66,111.12 JP19.2
USB_1
  Top 0.406: X2.1 12.69,87.01 13.97,85.72 R12.1
USB_2  (via drill 0.6)
  Top 0.254: X2.2 11.9,86.21 13.65,84.45 v24.45,84.45 v26.35,84.45 33.34,84.45 33.74,84.86 IC02.16
USB_3  (via drill 0.58, 0.6)
  Top 0.254: v28.26,83.19 v26.35,83.19 16.19,83.19 15.88,83.5 13.34,83.5 11.43,85.41 X2.3 | IC02.15 v30.58,85.5
  Bottom 0.254: v30.58,85.5 v28.26,83.19
XTAL
  Top 0.254: 75.25,69.85 75.25,68.99 Q2.2 | C17.1 70.51,71.75 69.17,70.42 IC01.9
  Top 0.406: R50.2 C17.1 73.34,71.75 75.25,69.85
(copper drawn outside any net)
  shapes: Bottom circle x1

## Text on the board
Bottom: Demoboard | MC9S08DZ60 | Vers. 1.0 | c 2020 | TFO Meran | DLN:18703
tPlace: Bluetooth | TFT or 5510 Nokia | EN | VCC | GND | <-RX | ->TX | STATE | GND | BG | VCC | CLK | DIN | D/C | CS | RST | GND | TX2/PF0 | RX2/PF1 | GND | CLK | MISO | MOSI | !SS | +3V3 | SDA/PF3 | SCL/PF2 | Vcc | GND | +5V | BDM | SCI2 | SPI | I2C | DLN:18703 | 5V | 3V3 | SPI: | V | cc | I²C | LCD | Kontrast | PG4=Backlight | PG3=E PG2=RS | PA[0..7]=Data LCD | SCL=PF2 | SDA=PF3 | Jumper zu: SPI mit 3,3V | Jumper offen: SPI mit 5V | Rev. 1.0 | design by Deto | MC9S08DZxx_LH | c 2020 | Meran | 8-12V | PB0 | PB1 | PD7 | PD6 | PD5 | PD4 | PD3 | PD2 | PD1 | PD0 | PC7 | PC6 | PC5 | PC4 | PC3 | PC2 | PC1 | PC0 | PB2 | PB3 | PD7 | PD6 | PD5 | PD4 | PD3 | PD2 | PD1 | PD0 | +5V | GND | PB4 | PB5 | PB6 | PB7 | +5V | GND | PD7 | PD5 | PD4 | PD3 | PD2 | PD1 | PD0 | PD6
Document: Done: | Widerstand bei I2C eingefügt | PORTD umgedreht | Beschriftungen bei Stecker I2C richtig gestellt | Beschriftungen bei Stecker SPI richtig gestellt | Beschriftungen bei Stecker SCI2 richtig gestellt | Jumper bei SPI-Select näher zusammengerückt